# EAGLE design SPL_1_0 (EAGLE 8.3.2)
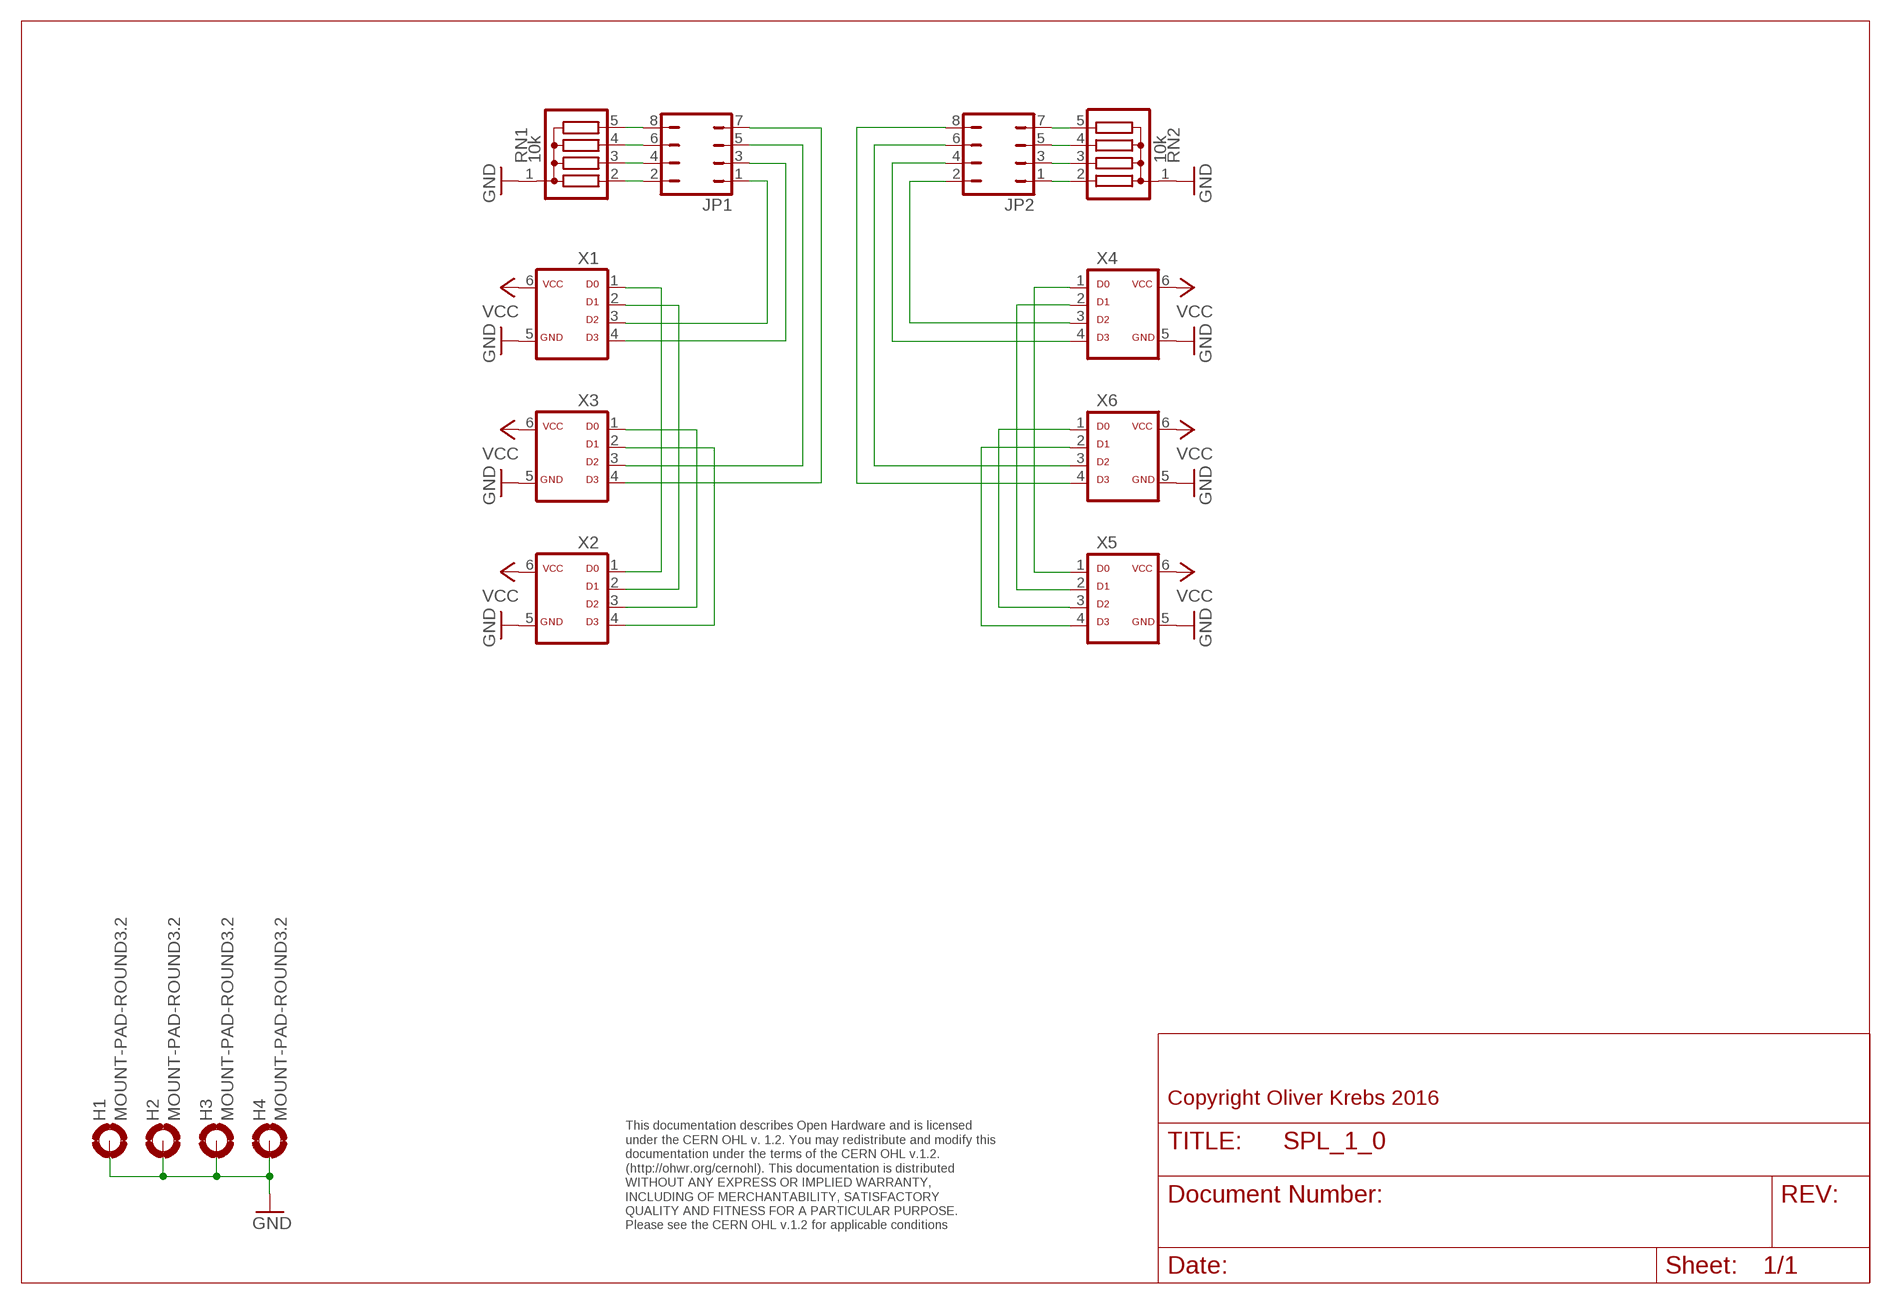
[diagram p0: schematic, sheet 1]

## Parts
H1  MOUNT-PAD-ROUND3.2  [3,2-PAD]
H2  MOUNT-PAD-ROUND3.2  [3,2-PAD]
H3  MOUNT-PAD-ROUND3.2  [3,2-PAD]
H4  MOUNT-PAD-ROUND3.2  [3,2-PAD]
JP1  JP4Q  [JP4Q]
JP2  JP4Q  [JP4Q]
RN1  10k  G04R  [SIL5]
RN2  10k  G04R  [SIL5]
X1  ML6D  [ML-6]
X2  ML6D  [ML-6]
X3  ML6D  [ML-6]
X4  ML6D  [ML-6]
X5  ML6D  [ML-6]
X6  ML6D  [ML-6]

## Nets
GND: H1.B3,2(MOUNT) H2.B3,2(MOUNT) H3.B3,2(MOUNT) H4.B3,2(MOUNT) RN1.1 RN2.1 X1.5 X2.5 X3.5 X4.5 X5.5 X6.5
N$1: X1.1 X2.1
N$2: X1.2 X2.2
N$3: X2.3 X3.1
N$4: X2.4 X3.2
N$5: X4.1 X5.1
N$6: X4.2 X5.2
N$7: X5.3 X6.1
N$8: X5.4 X6.2
N$9: JP1.2 RN1.2
N$10: JP1.4 RN1.3
N$11: JP1.6 RN1.4
N$12: JP1.8 RN1.5
N$13: JP2.1 RN2.2
N$14: JP2.3 RN2.3
N$15: JP2.5 RN2.4
N$16: JP2.7 RN2.5
N$17: JP1.1 X1.3
N$18: JP1.3 X1.4
N$19: JP1.5 X3.3
N$20: JP1.7 X3.4
N$21: JP2.8 X6.4
N$22: JP2.6 X6.3
N$23: JP2.4 X4.4
N$24: JP2.2 X4.3
VCC: X1.6 X2.6 X3.6 X4.6 X5.6 X6.6

## Notes on the sheet
- Copyright Oliver Krebs 2016
- This documentation describes Open Hardware and is licensed 
  under the CERN OHL v. 1.2. You may redistribute and modify this 
  documentation under the terms of the CERN OHL v.1.2. 
  (http://ohwr.org/cernohl). This documentation is distributed
  WITHOUT ANY EXPRESS OR IMPLIED WARRANTY, 
  INCLUDING OF MERCHANTABILITY, SATISFACTORY 
  QUALITY AND FITNESS FOR A PARTICULAR PURPOSE. 
  Please see the CERN OHL v.1.2 for applicable conditions

## Library data of the parts
H1-H4 = holes:MOUNT-PAD-ROUND: MOUNTING PAD, round
JP1 JP2 = 01-my-con:JP4Q
RN1 RN2 = resistor-sil:G04R: SIL RESISTOR; OC_FARNELL: unknown; OC_NEWARK: unknown
X1-X6 = 01-my-con:ML6D

## Board
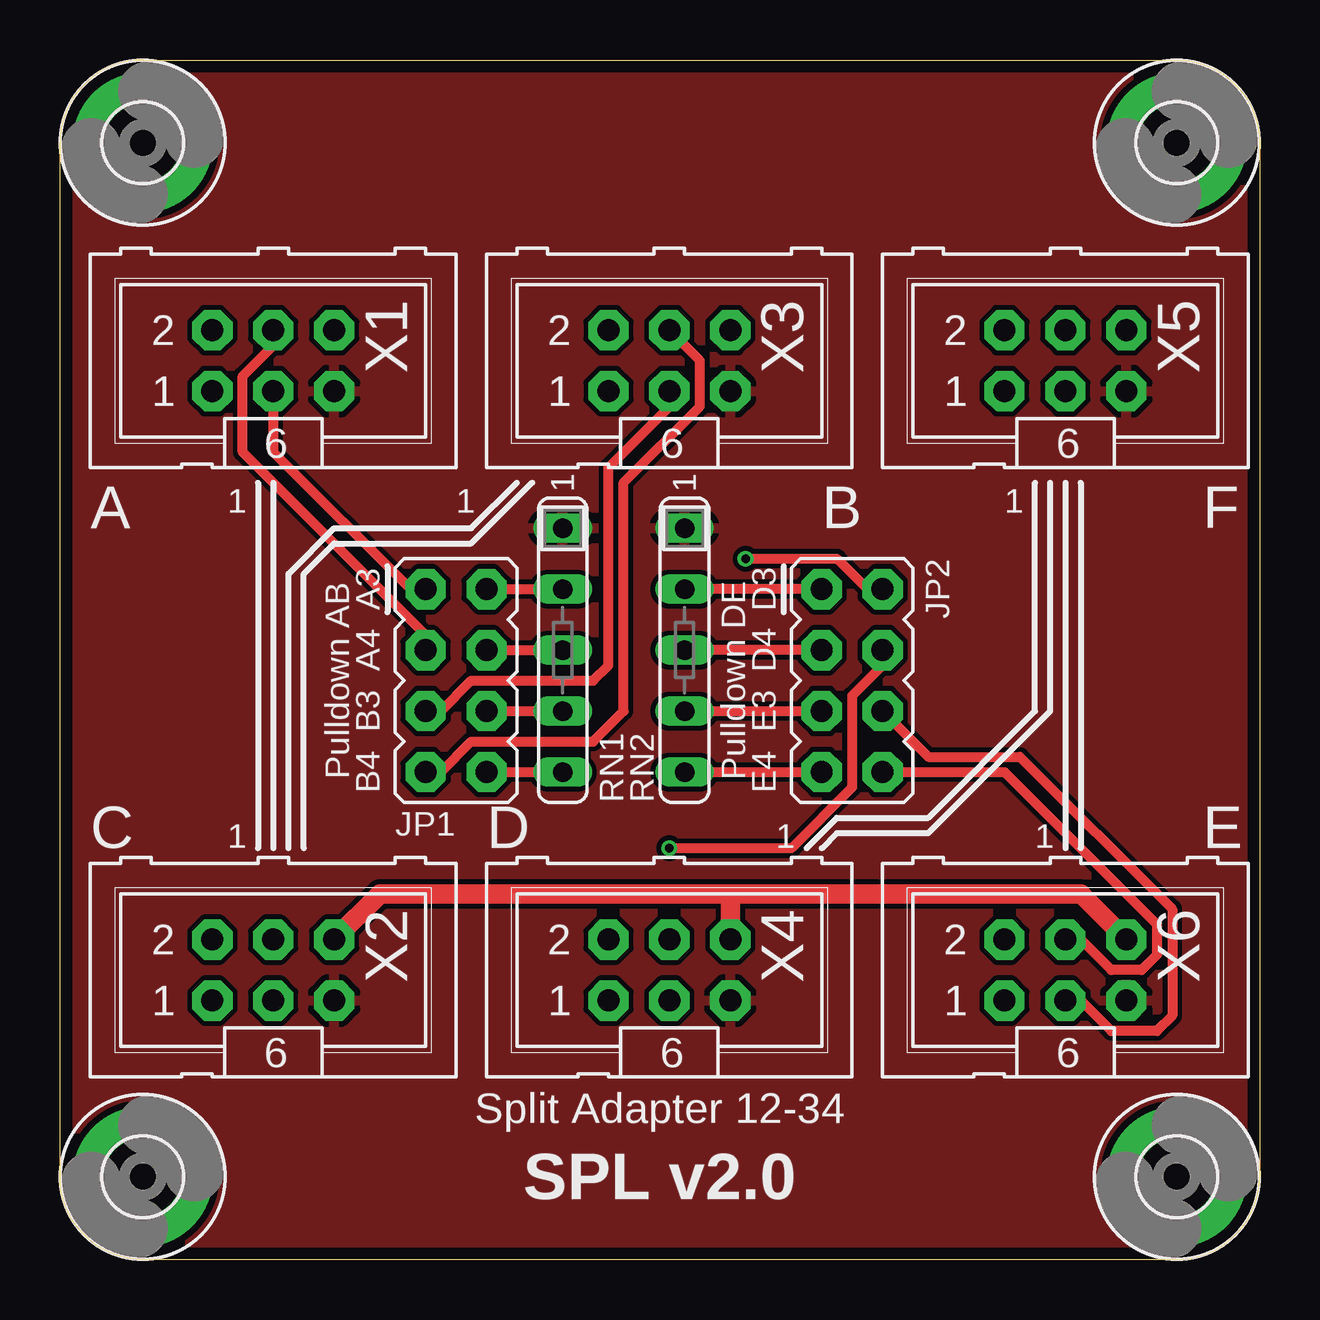
[diagram p1: board, top side]
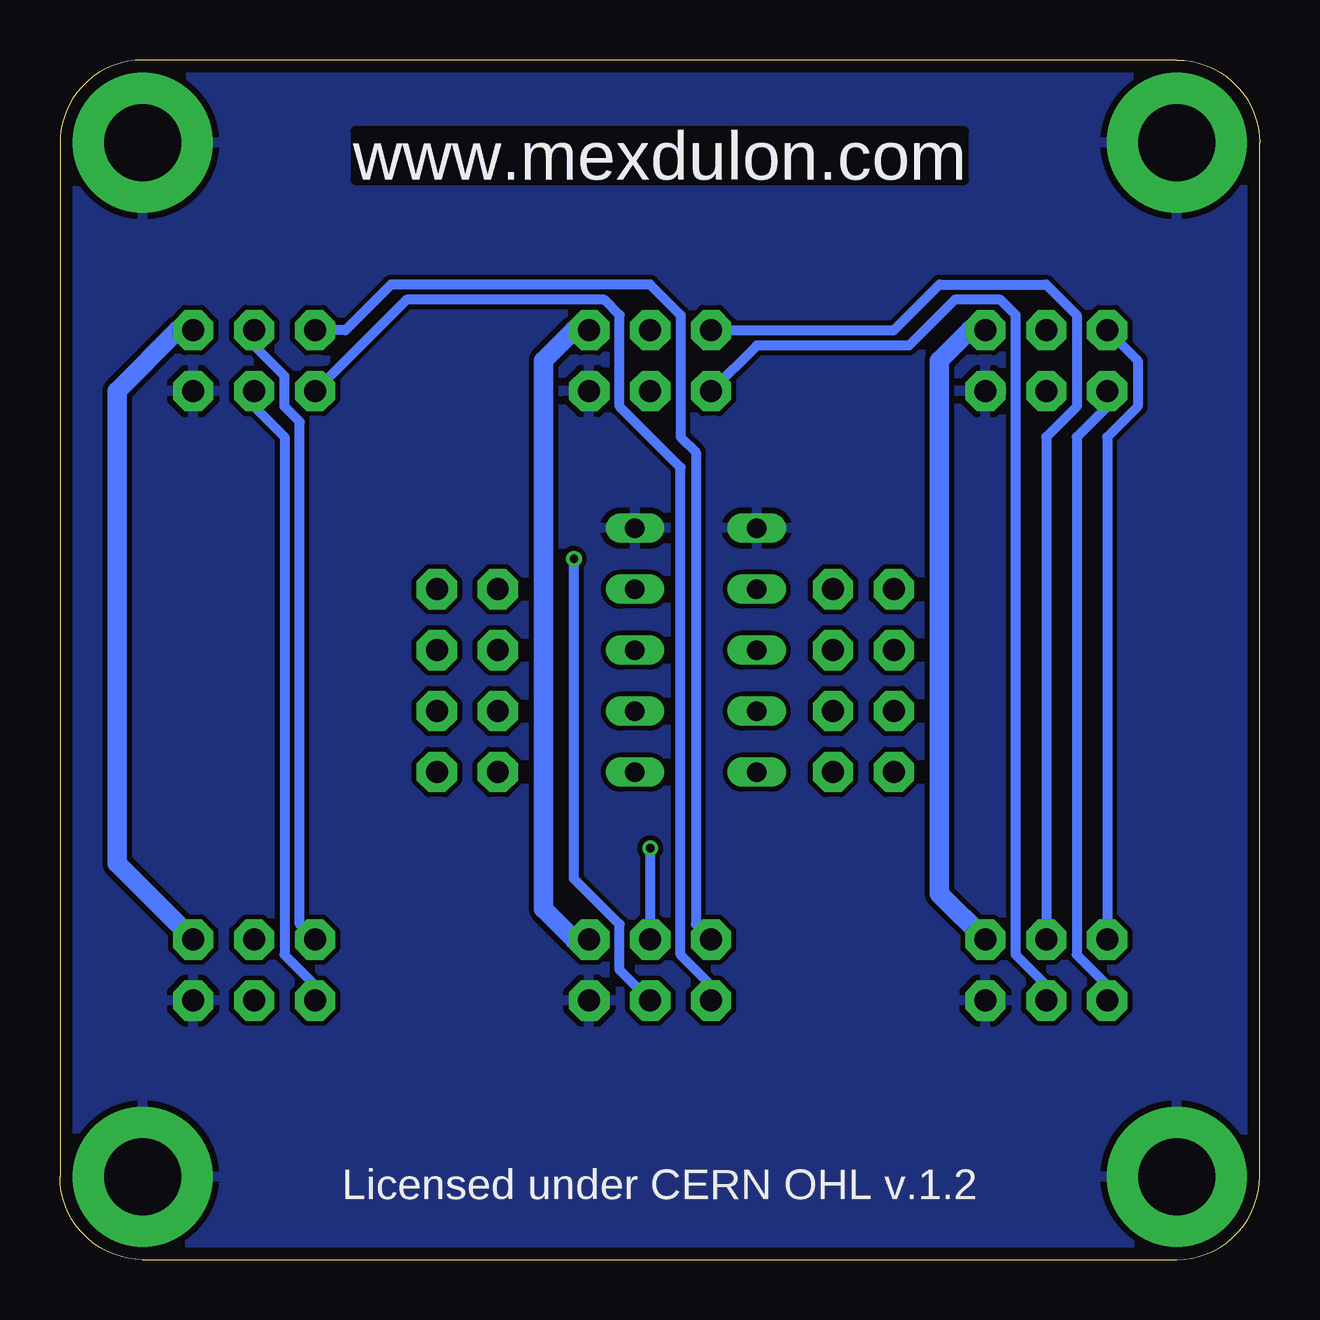
[diagram p2: board, bottom side, seen from below]

Size 50 x 50 mm. Coordinates in mm from the lower left corner, seen from the top.
Outline: 0,3.45 0,46.55 arc-90 3.45,50 46.55,50 arc-90 50,46.55 50,3.45 arc-90 46.55,0 3.45,0 arc-90 0,3.45
Copper layers (1*16): Top 0.035mm / dielectric 1.6mm / Bottom 0.035mm
Design rules "Elecrow_2-layer_PCB_eagle_rule_8mil": minimum track width 8mil, minimum drill 12mil, track to track 8mil, track to pad 8mil, pad to pad 8mil, via to via 8mil, smd to smd 0mil, copper to edge 20mil, drill to drill 10mil, minimum pad ring 6mil, minimum via ring 6mil, stop-mask expansion 0mil, vias tented up to drill 100mil, thermal gap 10mil

### Footprints (pad centres in the part's own frame; a part is rotated, then mirrored left to right if it is on the bottom)
3,2-PAD = drill 3.2 pad 5.842: B3,2 0,0
JP4Q = drill 0.914 pad 1.676 octagon: 1 -3.81,-1.27; 2 -3.81,1.27; 3 -1.27,-1.27; 4 -1.27,1.27; 5 1.27,-1.27; 6 1.27,1.27; 7 3.81,-1.27; 8 3.81,1.27
SIL5 = drill 0.813 long: 1 -5.08,0; 2 -2.54,0; 3 0,0; 4 2.54,0; 5 5.08,0
ML-6 = drill 0.914 pad 1.676 octagon: 1 -2.54,-1.27; 2 -2.54,1.27; 3 0,-1.27; 4 0,1.27; 5 2.54,-1.27; 6 2.54,1.27

### Placement (x,y rotation side)
H1  3.45,3.45 0 top
H2  3.45,46.55 0 top
H3  46.55,3.45 0 top
H4  46.55,46.55 0 top
JP1  16.51,24.13 270 top
JP2  33.02,24.13 270 top
RN1  20.95,25.4 270 top
RN2  26.04,25.4 270 top
X1  8.89,37.47 0 top
X2  8.89,12.06 0 top
X3  25.4,37.47 0 top
X4  25.4,12.06 0 top
X5  41.91,37.47 0 top
X6  41.91,12.06 0 top

### Tracks (layer width: path | path; a pad name or v marks a point on that pad's centre or on a via)
GND
  pour Bottom: 0,0 50.8,0 50.8,50.8 0,50.8
  pour Top: 0,50.16 50.16,50.16 50.16,0 0,0
N$1
  Bottom 0.406: X1.1 6.35,35.56 7.62,34.29 7.62,12.7 6.35,11.43 X2.1
N$2
  Bottom 0.406: X1.2 5.08,37.47 5.08,35.56 6.35,34.29 X2.2
N$3
  Bottom 0.406: X2.3 8.89,11.43 10.16,12.7 10.16,39.37 10.79,40.01 12.7,40.01 14.61,38.1 20.95,38.1 X3.1
N$4
  Bottom 0.406: X3.2 15.24,38.73 13.34,40.64 8.89,40.64 7.62,39.37 7.62,35.56 8.89,34.29 X2.4
N$5
  Bottom 0.406: X4.1 22.86,11.43 24.13,12.7 24.13,33.02 26.67,35.56 26.67,39.37 27.3,40.01 35.56,40.01 X5.1
N$6
  Bottom 0.406: X4.2 23.5,13.97 23.5,33.66 24.13,34.29 24.13,39.37 25.4,40.64 36.2,40.64 38.1,38.73 X5.2
N$7
  Bottom 0.406: X5.3 41.91,35.56 40.64,34.29 40.64,12.7 39.37,11.43 X6.1
N$8
  Bottom 0.406: X5.4 41.91,38.1 40.64,36.83 40.64,35.56 40.01,34.92 40.01,13.97 X6.2
N$9
  Top 0.406: JP1.2 RN1.2
N$10
  Top 0.406: JP1.4 RN1.3
N$11
  Top 0.406: JP1.6 RN1.4
N$12
  Top 0.406: JP1.8 RN1.5
N$13
  Top 0.406: JP2.1 RN2.2
N$14
  Top 0.406: JP2.3 RN2.3
N$15
  Top 0.406: RN2.4 JP2.5
N$16
  Top 0.406: RN2.5 JP2.7
N$17
  Top 0.406: JP1.1 14.61,27.94 8.89,33.66 X1.3
N$18
  Top 0.406: JP1.3 15.24,26.04 7.62,33.66 7.62,36.83 8.89,38.1 X1.4
N$19
  Top 0.406: JP1.5 15.88,22.86 17.14,24.13 22.23,24.13 22.86,24.77 22.86,33.02 25.4,35.56 X3.3
N$20
  Top 0.406: JP1.7 15.88,20.32 17.14,21.59 22.23,21.59 23.5,22.86 23.5,32.38 26.67,35.56 26.67,37.47 X3.4
N$21
  Top 0.406: JP2.8 39.37,20.32 45.72,13.97 45.72,12.7 45.09,12.06 43.81,12.06 42.55,13.34 X6.4
N$22
  Top 0.406: X6.3 42.55,10.79 43.81,9.53 45.72,9.53 46.35,10.16 46.35,14.61 40.01,20.95 36.2,20.95 JP2.6
N$23  (via drill 0.35)
  Top 0.406: JP2.4 34.29,24.77 33.02,23.5 33.02,19.68 30.48,17.14 v25.4,17.14
  Bottom 0.406: v25.4,17.14 X4.4
N$24  (via drill 0.35)
  Top 0.406: v28.57,29.21 32.38,29.21 33.66,27.94 JP2.2
  Bottom 0.406: X4.3 26.67,12.06 26.67,13.97 28.57,15.88 v28.57,29.21
VCC
  Top 0.813: X2.6 13.34,15.24 27.94,15.24 | 27.94,15.24 42.55,15.24 X6.6 | X4.6 27.94,15.24
  Bottom 0.813: X2.6 13.34,15.24 13.34,37.47 12.06,38.73 X1.6 | X4.6 28.57,13.34 29.84,14.61 29.84,37.47 28.57,38.73 X3.6 | X5.6 45.09,38.73 47.62,36.2 47.62,16.51 X6.6

### Text on the board
Bottom: www.mexdulon.com
tPlace: 1 | 1 | 1 | A | B | F | A3 | D3 | A4 | D4 | Pulldown AB | Pulldown DE | B3 | E3 | B4 | E4 | C | 1 | D | 1 | 1 | E
tNames: Split Adapter 12-34 | SPL v2.0
bNames: www.mexdulon.com | Licensed under CERN OHL v.1.2